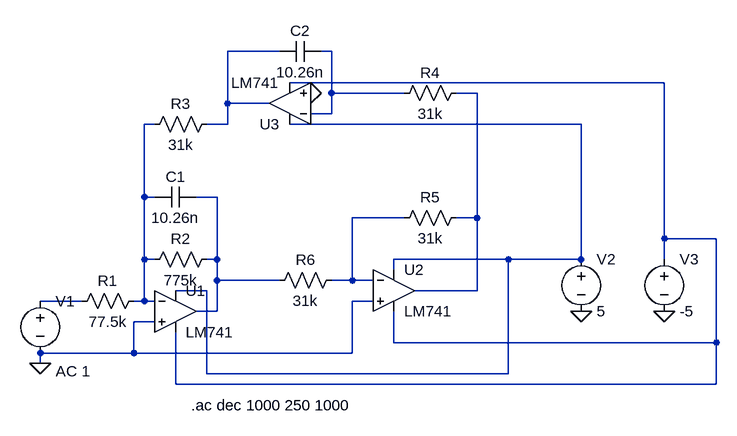
[diagram p0: schematic ThreeOABiquadBandpass.asc]
ThreeOABiquadBandpass.asc, the LTspice schematic file:
Version 4
SHEET 1 1016 680
WIRE 336 -208 256 -208
WIRE 416 -208 400 -208
WIRE 928 -160 352 -160
WIRE 416 -144 416 -208
WIRE 528 -144 416 -144
WIRE 640 -144 608 -144
WIRE 256 -128 256 -208
WIRE 320 -128 256 -128
WIRE 416 -112 416 -144
WIRE 416 -112 384 -112
WIRE 144 -96 128 -96
WIRE 256 -96 256 -128
WIRE 256 -96 224 -96
WIRE 800 -96 352 -96
WIRE 128 16 128 -96
WIRE 144 16 128 16
WIRE 240 16 208 16
WIRE 528 48 448 48
WIRE 640 48 640 -144
WIRE 640 48 608 48
WIRE 928 80 928 -160
WIRE 1008 80 928 80
WIRE 128 112 128 16
WIRE 144 112 128 112
WIRE 240 112 240 16
WIRE 240 112 224 112
WIRE 688 112 512 112
WIRE 800 112 800 -96
WIRE 800 112 688 112
WIRE 928 112 928 80
WIRE 512 128 512 112
WIRE 240 144 240 112
WIRE 336 144 240 144
WIRE 448 144 448 48
WIRE 448 144 416 144
WIRE 480 144 448 144
WIRE 224 160 176 160
WIRE 640 160 640 48
WIRE 640 160 544 160
WIRE 32 176 -32 176
WIRE 128 176 128 112
WIRE 128 176 112 176
WIRE 144 176 128 176
WIRE 480 176 448 176
WIRE 240 192 240 144
WIRE 240 192 208 192
WIRE 144 208 112 208
WIRE 512 240 512 192
WIRE 1008 240 1008 80
WIRE 1008 240 512 240
WIRE 112 256 112 208
WIRE 112 256 -32 256
WIRE 448 256 448 176
WIRE 448 256 112 256
WIRE -32 272 -32 256
WIRE 224 288 224 160
WIRE 688 288 688 112
WIRE 688 288 224 288
WIRE 176 304 176 224
WIRE 1008 304 1008 240
WIRE 1008 304 176 304
FLAG 384 -144 0
FLAG -32 272 0
FLAG 800 192 0
FLAG 928 192 0
SYMBOL res 128 160 R90
WINDOW 0 0 56 VBottom 2
WINDOW 3 32 56 VTop 2
SYMATTR InstName R1
SYMATTR Value 77.5k
SYMBOL res 240 96 R90
WINDOW 0 0 56 VBottom 2
WINDOW 3 32 56 VTop 2
SYMATTR InstName R2
SYMATTR Value 775k
SYMBOL res 240 -112 R90
WINDOW 0 0 56 VBottom 2
WINDOW 3 32 56 VTop 2
SYMATTR InstName R3
SYMATTR Value 31k
SYMBOL res 624 -160 R90
WINDOW 0 0 56 VBottom 2
WINDOW 3 32 56 VTop 2
SYMATTR InstName R4
SYMATTR Value 31k
SYMBOL res 624 32 R90
WINDOW 0 0 56 VBottom 2
WINDOW 3 32 56 VTop 2
SYMATTR InstName R5
SYMATTR Value 31k
SYMBOL res 432 128 R90
WINDOW 0 0 56 VBottom 2
WINDOW 3 32 56 VTop 2
SYMATTR InstName R6
SYMATTR Value 31k
SYMBOL cap 208 0 R90
WINDOW 0 0 32 VBottom 2
WINDOW 3 32 32 VTop 2
SYMATTR InstName C1
SYMATTR Value 10.26n
SYMBOL cap 400 -224 R90
WINDOW 0 0 32 VBottom 2
WINDOW 3 32 32 VTop 2
SYMATTR InstName C2
SYMATTR Value 10.26n
SYMBOL voltage -32 160 R0
WINDOW 123 24 124 Left 2
WINDOW 39 0 0 Left 0
SYMATTR Value2 AC 1
SYMATTR InstName V1
SYMATTR Value ""
SYMBOL OpAmps\\LM741 176 128 R0
SYMATTR InstName U1
SYMBOL OpAmps\\LM741 512 96 R0
SYMATTR InstName U2
SYMBOL OpAmps\\LM741 352 -64 R180
SYMATTR InstName U3
SYMBOL voltage 800 96 R0
WINDOW 123 0 0 Left 0
WINDOW 39 0 0 Left 0
SYMATTR InstName V2
SYMATTR Value 5
SYMBOL voltage 928 96 R0
WINDOW 123 0 0 Left 0
WINDOW 39 0 0 Left 0
SYMATTR InstName V3
SYMATTR Value -5
TEXT 200 336 Left 2 !.ac dec 1000 250 1000

The netlist it stands for:
* ThreeOABiquadBandpass.asc
R1 N005 N009 77.5k
R2 N007 N005 775k
R3 N001 N005 31k
R4 N004 N002 31k
R5 N004 N008 31k
R6 N008 N007 31k
C1 N007 N005 10.26n
C2 N002 N001 10.26n
V1 N009 0 AC 1
XU1 0 N005 N006 N003 N007 LM741  ; pins In+ In- V+ V- OUT
XU2 0 N008 N006 N003 N004 LM741  ; pins In+ In- V+ V- OUT
XU3 0 N002 N006 N003 N001 LM741  ; pins In+ In- V+ V- OUT
V2 N006 0 5
V3 N003 0 -5
.ac dec 1000 250 1000
.lib LM741.lib
.backanno
.end